# Altium schematic sheet Geiger_Pwr.SchDoc
size A4
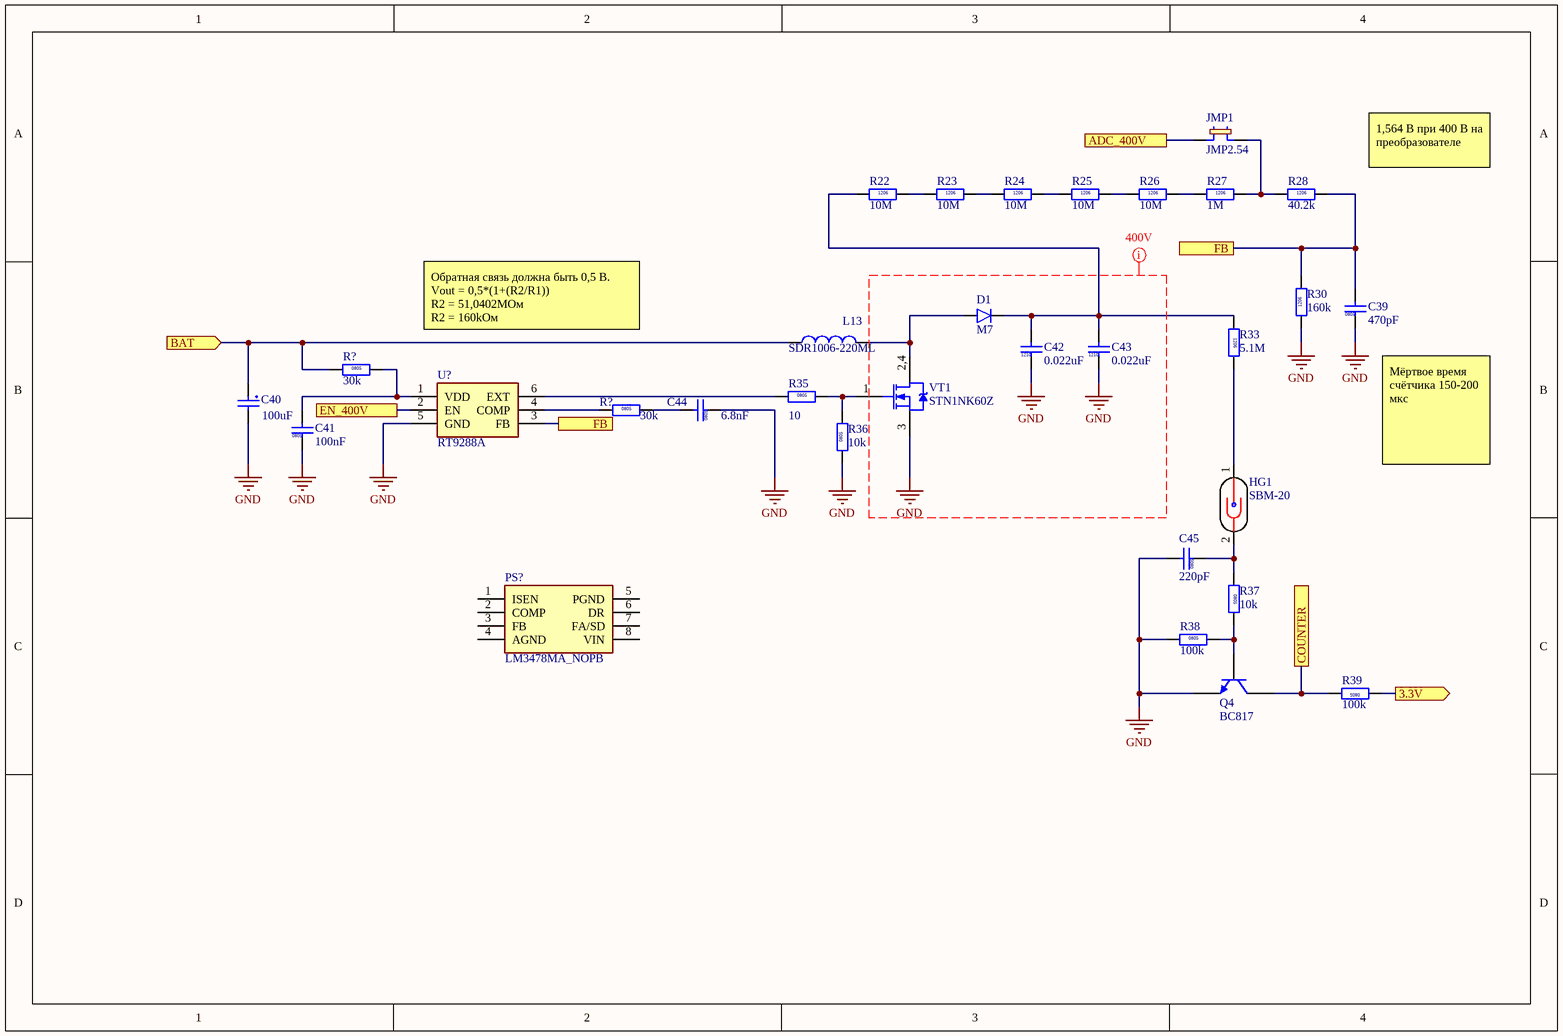
[diagram p0: Geiger_Pwr.SchDoc]

## Parts
(Parts that share a designator on the sheet are numbered #1, #2 ... from top to bottom, then left to right.)
C39  value 470pF  [CAPC2012-0805M]  (hidden comment: CAPC_0805)
C40  value 100uF  [ECAP511]  (hidden comment: ECAP-511)
C41  value 100nF  [CAPC2012-0805M]  (hidden comment: CAPC_0805)
C42  value 0.022uF  [CAPC3225-1210L]  (hidden comment: CAPC_1210)
C43  value 0.022uF  [CAPC3225-1210L]  (hidden comment: CAPC_1210)
C44  value 6.8nF  [CAPC2012-0805M]  (hidden comment: CAPC_0805)
C45  value 220pF  [CAPC2012-0805M]  (hidden comment: CAPC_0805)
D1  M7  [DIOM5026X262N]
HG1  SBM-20  [SBM20]
JMP1  JMP2.54  [JMP2.54]
L13  SDR1006-220ML  [SDR1006]
PS?  LM3478MA_NOPB  [SOIC127P600X175-8N]
Q4  BC817  [SOT23-3M]
R22  value 10M  [RESC3216-1206M]  (hidden comment: RESC_1206_R)
R23  value 10M  [RESC3216-1206M]  (hidden comment: RESC_1206_R)
R24  value 10M  [RESC3216-1206M]  (hidden comment: RESC_1206_R)
R25  value 10M  [RESC3216-1206M]  (hidden comment: RESC_1206_R)
R26  value 10M  [RESC3216-1206M]  (hidden comment: RESC_1206_R)
R27  value 1M  [RESC3216-1206M]  (hidden comment: RESC_1206_R)
R28  value 40.2k  [RESC3216-1206M]  (hidden comment: RESC_1206_R)
R30  value 160k  [RESC3216-1206M]  (hidden comment: RESC_1206_R)
R33  value 5.1M  [RESC3216-1206M]  (hidden comment: RESC_1206_R)
R35  value 10  [RESC2012-0805M]  (hidden comment: RESC_0805_R)
R36  value 10k  [RESC2012-0805M]  (hidden comment: RESC_0805_R)
R37  value 10k  [RESC2012-0805M]  (hidden comment: RESC_0805_R)
R38  value 100k  [RESC2012-0805M]  (hidden comment: RESC_0805_R)
R39  value 100k  [RESC2012-0805M]  (hidden comment: RESC_0805_R)
R?#1  value 30k  [RESC2012-0805M]  (hidden comment: RESC_0805_R)
R?#2  value 30k  [RESC2012-0805M]  (hidden comment: RESC_0805_R)
U?  RT9288A  [SOT95P270X145-6N]
VT1  STN1NK60Z  [SOT230P700X182-4N]

## Ports
3.3V (out), ADC_400V, BAT (in), COUNTER, EN_400V, FB

## Nets
GND: C39.1 C40.2 C41.1 C42.1 C43.1 C44.1 C45.2 Q4.2(E) R30.1 R36.1 R38.1 U?.5(GND) VT1.3(S)
3.3V: R39.1 ; port 3.3V
ADC_400V: JMP1.1 ; port ADC_400V
BAT: C40.1 L13.1 R?#1.1 ; port BAT
COUNTER: Q4.3(C) R39.2 ; port COUNTER
EN_400V: U?.2(EN) ; port EN_400V
FB: C39.2 R28.2 R30.2 U?.3(FB) ; port FB
NetC41_2: C41.2 R?#1.2 U?.1(VDD)
NetC42_2: C42.2 C43.2 D1.1(K) R22.1 R33.1
NetC44_2: C44.2 R?#2.2
NetC45_1: C45.1 HG1.2(K) R37.1
NetD1_2: D1.2(A) L13.2 VT1.2,4(D)
NetHG1_1: HG1.1(A) R33.2
NetJMP1_2: JMP1.2 R27.2 R28.1
NetQ4_1: Q4.1(B) R37.2 R38.2
NetR22_2: R22.2 R23.1
NetR23_2: R23.2 R24.1
NetR24_2: R24.2 R25.1
NetR25_2: R25.2 R26.1
NetR26_2: R26.2 R27.1
NetR35_1: R35.1 U?.6(EXT)
NetR35_2: R35.2 R36.2 VT1.1(G)
NetR?#2_1: R?#2.1 U?.4(COMP)

Not connected (* = marked no-connect by the designer): PS? 1(ISEN) 2(COMP) 3(FB) 4(AGND) 5(PGND) 6(DR) 7(FA/SD) 8(VIN)

## Layout directives
mark named 400V: GND

## Notes on the sheet
- 1,564 В при 400 В на преобразователе
- Обратная связь должна быть 0,5 В.
  Vout = 0,5*(1+(R2/R1))
  R2 = 51,0402МОм
  R2 = 160kОм
- (near C39) Мёртвое время счётчика 150-200 мкс
- (in symbol CAPC_0805) 0805
- (in symbol CAPC_1210) 1210
- (in symbol RESC_0805_R) 0805
- (in symbol RESC_1206_R) 1206

## Library data of the parts
C39 C41 C44 C45 = CAPC_0805: Capacitor 0805
C40 = ECAP-511: Capacitor electrolytic 2.5 mm pitch, 5*11 body
C42 C43 = CAPC_1210: Capacitor 1210
D1 = M7: Diode; Manufacturer_Name: MULTICOMP; Manufacturer_Part_Number: SS34A; Datasheet Link: https://componentsearchengine.com/Datasheets/2/SS34A.pdf; Height: 2.62mm
JMP1 = JMP2.54: 2.54mm single jumper
L13 = SDR1006-220ML: Connector; Manufacturer_Name: Bourns; Allied_Number: 70154258; Datasheet Link: https://www.mouser.com/datasheet/2/54/DR1006-1391503.pdf; Height: 5.8mm; Manufacturer_Part_Number: SDR1006-220ML; Mouser Part Number: 652-SDR1006-220ML; Mouser Price/Stock: https://www.mouser.com/Search/Refine.aspx?Keyword=652-SDR1006-220ML; RS Part Number: 7361349P; RS Price/Stock: http://uk.rs-online.com/web/p/products/7361349P; Allied Price/Stock: https://www.alliedelec.com/bourns-sdr1006-220ml/70154258/
PS? = LM3478MA_NOPB: Power Supply; Manufacturer_Name: Texas Instruments; Manufacturer_Part_Number: LM3478MA/NOPB; Datasheet Link: http://www.ti.com/lit/gpn/lm3478; Height: 1.75mm; Mouser Part Number: 926-LM3478MA/NOPB; Mouser Price/Stock: https://www.mouser.com/Search/Refine.aspx?Keyword=926-LM3478MA%2FNOPB; RS Part Number: 8115560P; RS Price/Stock: http://uk.rs-online.com/web/p/products/8115560P
Q4 = BC817: BC817 NPN Transistor
R22-R28 R30 R33 = RESC_1206_R: Resistor 1206
R35-R39 R?#1 R?#2 = RESC_0805_R: Resistor 0805
U? = RT9288A: Integrated Circuit; Manufacturer_Name: Microchip; Manufacturer_Part_Number: 25AA02E64T-I/OT; Datasheet Link: http://uk.rs-online.com/web/p/products/8261745; Height: 1.45mm; Mouser Part Number: 579-25AA02E64T-I/OT; Mouser Price/Stock: https://www.mouser.com/Search/Refine.aspx?Keyword=579-25AA02E64T-I%2FOT; RS Part Number: 8261745; RS Price/Stock: https://uk.rs-online.com/web/p/products/8261745